# EAGLE design magnetolocator (EAGLE 9.5.2)
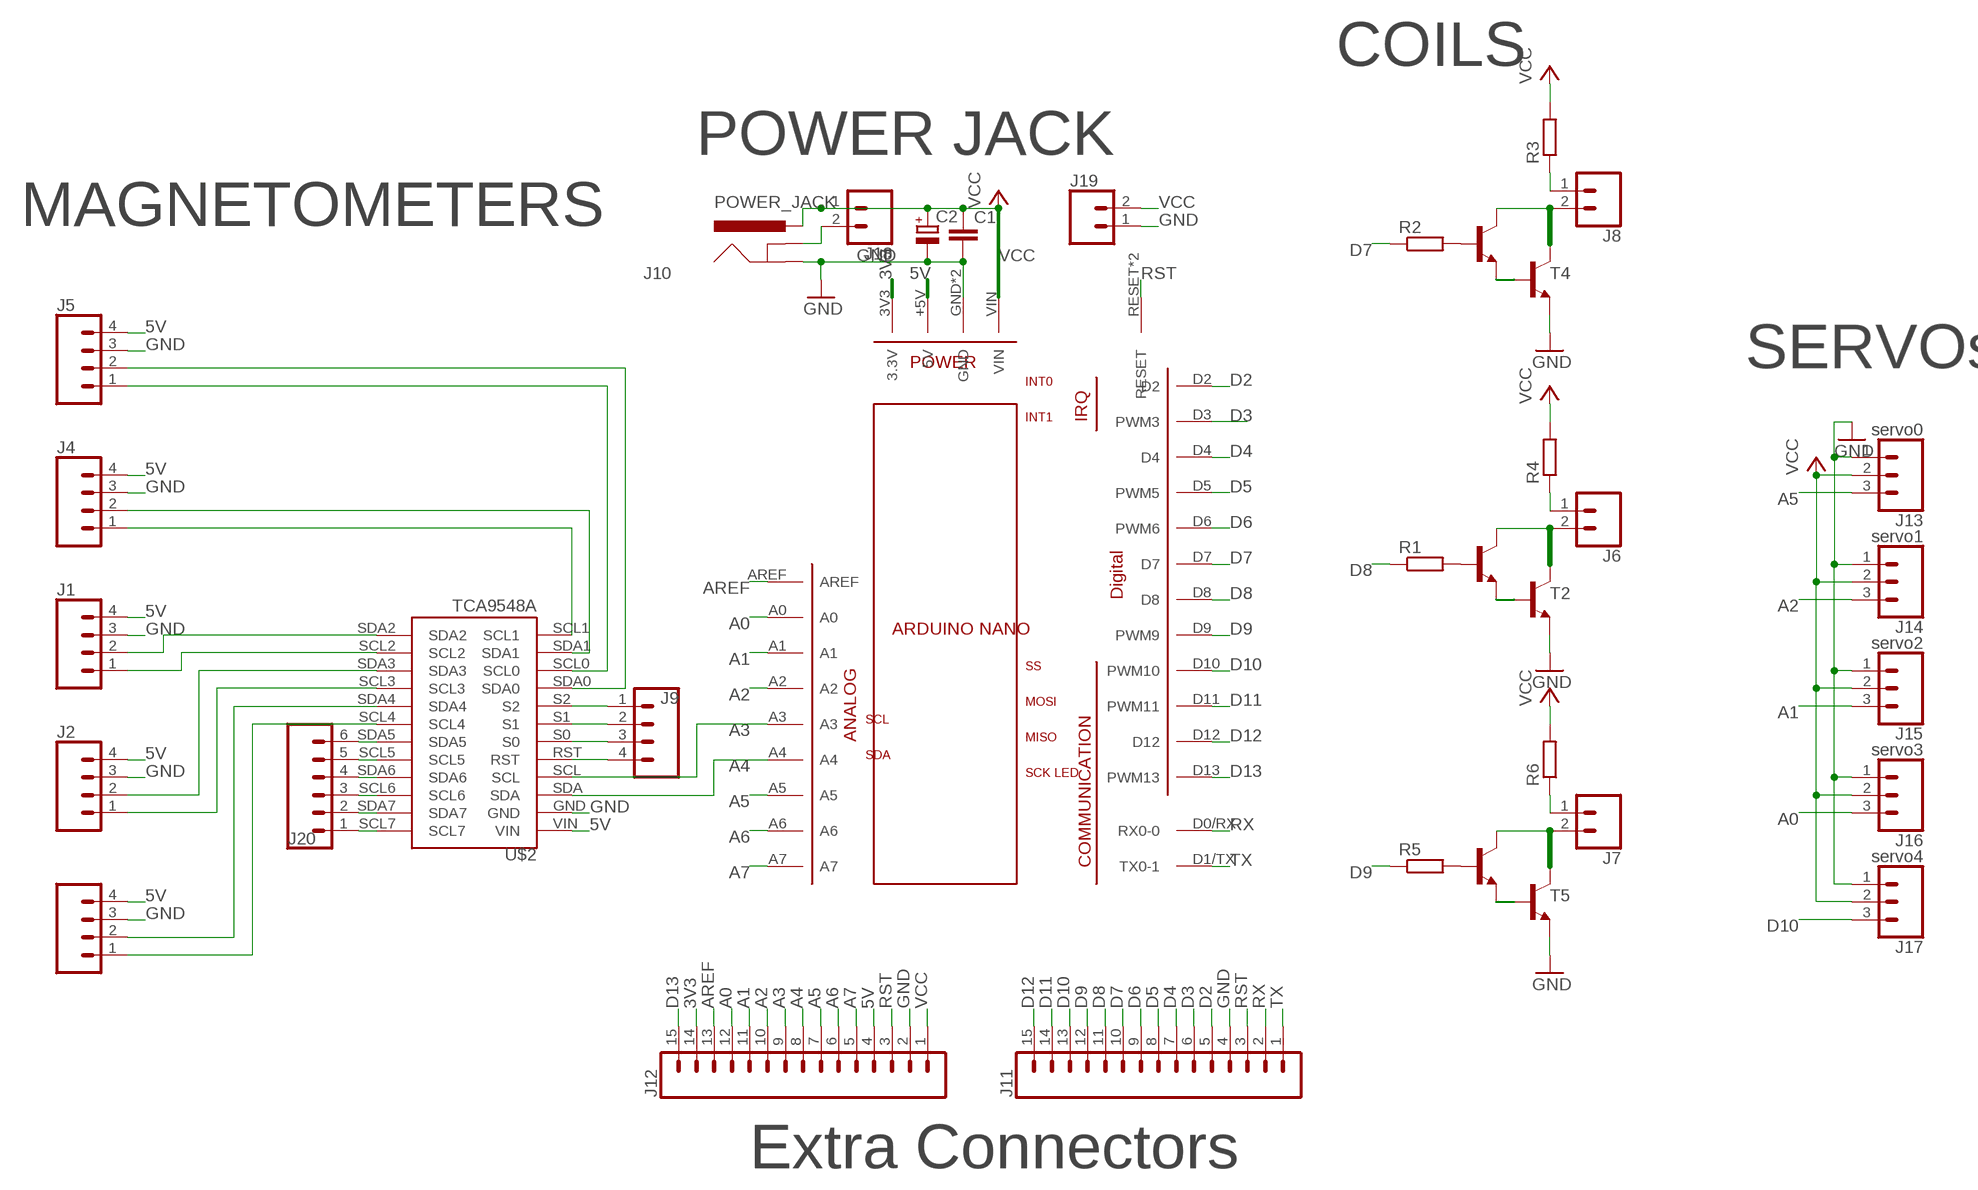
[diagram p0: schematic, sheet 1]

## Parts
C1  C-EU025-025X050  [C025-025X050]
C2  CPOL-EUE2.5-5  [E2,5-5]
J1  CONN_04PTH  [1X04]
J2  CONN_04PTH  [1X04]
J3  CONN_04PTH  [1X04]
J4  CONN_04PTH  [1X04]
J5  CONN_04PTH  [1X04]
J6  CONN_02  [1X02]
J7  CONN_02  [1X02]
J8  CONN_02  [1X02]
J9  CONN_04PTH  [1X04]
J10  POWER_JACK  [POWER_JACK_PTH]
J11  CONN_15  [1X15]
J12  CONN_15  [1X15]
J13  servo0  CONN_03  [1X03]
J14  servo1  CONN_03  [1X03]
J15  servo2  CONN_03  [1X03]
J16  servo3  CONN_03  [1X03]
J17  servo4  CONN_03  [1X03]
J18  CONN_02  [1X02]
J19  CONN_02  [1X02]
J20  CONN_06NO_SILK_FEMALE_PTH  [1X06_NO_SILK]
R1  R-EU_0207/2V  [0207/2V]
R2  R-EU_0207/2V  [0207/2V]
R3  R-EU_0207/2V  [0207/2V]
R4  R-EU_0207/2V  [0207/2V]
R5  R-EU_0207/2V  [0207/2V]
R6  R-EU_0207/2V  [0207/2V]
T1  2N2222-NPN-TO92-EBC  [TO92-EBC]
T2  2N2222-NPN-TO92-EBC  [TO92-EBC]
T3  2N2222-NPN-TO92-EBC  [TO92-EBC]
T4  2N2222-NPN-TO92-EBC  [TO92-EBC]
T5  2N2222-NPN-TO92-EBC  [TO92-EBC]
T6  2N2222-NPN-TO92-EBC  [TO92-EBC]
U$1  BOARD_ARDUINO-NANO  [BOARD_ARDUINO_NANO]
U$2  TCA9548A  [TCA9548A]

## Nets
3V3 [darlington]: J12.14 U$1.3V3(3.3V)
5V [power]: J1.4 J2.4 J3.4 J4.4 J5.4 J12.4 U$1.+5V(5V) U$2.VIN
A0: J12.12 J16.3 U$1.A0
A1: J12.11 J15.3 U$1.A1
A2: J12.10 J14.3 U$1.A2
A3: J12.9 U$1.A3 U$2.SCL
A4: J12.8 U$1.A4 U$2.SDA
A5: J12.7 J13.3 U$1.A5
A6: J12.6 U$1.A6
A7: J12.5 U$1.A7
AREF: J12.13 U$1.AREF
D2: J11.5 U$1.D2
D3: J11.6 U$1.D3(PWM3)
D4: J11.7 U$1.D4
D5: J11.8 U$1.D5(PWM5)
D6: J11.9 U$1.D6(PWM6)
D7: J11.10 R2.1 U$1.D7
D8: J11.11 R1.1 U$1.D8
D9: J11.12 R5.1 U$1.D9(PWM9)
D10: J11.13 J17.3 U$1.D10(PWM10)
D11: J11.14 U$1.D11(PWM11)
D12: J11.15 U$1.D12
D13: J12.15 U$1.D13(PWM13)
GND: C1.2 C2.- J1.3 J2.3 J3.3 J4.3 J5.3 J10.GND J11.4 J12.2 J13.1 J14.1 J15.1 J16.1 J17.1 J19.1 T2.E T4.E T5.E U$1.GND U$1.GND1(GND) U$2.GND
N$1: R2.2 T1.B
N$2: R1.2 T3.B
N$3: J3.1 U$2.SCL4
N$4: J3.2 U$2.SDA4
N$5 [coils]: J8.1 R3.1
N$6: J10.GNDBREAK J18.2
N$7 [darlington]: T1.E T4.B
N$8 [coils]: J8.2 T1.C T4.C
N$9: J2.1 U$2.SCL3
N$10: J2.2 U$2.SDA3
N$11 [coils]: J6.1 R4.1
N$12 [darlington]: T2.B T3.E
N$13: J1.1 U$2.SCL2
N$14: J1.2 U$2.SDA2
N$15 [coils]: J6.2 T2.C T3.C
N$16: R5.2 T6.B
N$17: J4.1 U$2.SCL1
N$18: J4.2 U$2.SDA1
N$19 [coils]: J7.1 R6.1
N$20 [darlington]: T5.B T6.E
N$21: J5.1 U$2.SCL0
N$22: J5.2 U$2.SDA0
N$23 [coils]: J7.2 T5.C T6.C
N$24: J9.1 U$2.S2
N$25: J9.2 U$2.S1
N$26: J9.3 U$2.S0
N$27: J9.4 U$2.RST
N$28: J20.1 U$2.SCL7
N$29: J20.2 U$2.SDA7
N$30: J20.3 U$2.SCL6
N$31: J20.4 U$2.SDA6
N$32: J20.5 U$2.SCL5
N$33: J20.6 U$2.SDA5
RST: J11.3 J12.3 U$1.RESET U$1.RESET1(RESET)
RX: J11.2 U$1.D0/RX(RX0-0)
TX: J11.1 U$1.D1/TX(TX0-1)
VCC [power]: C1.1 C2.+ J10.PWR J12.1 J13.2 J14.2 J15.2 J16.2 J17.2 J18.1 J19.2 R3.2 R4.2 R6.2 U$1.VIN

## Notes on the sheet
- COILS
- POWER JACK
- MAGNETOMETERS
- SERVOs
- Extra Connectors

## Library data of the parts
C1 = rcl:C-EU: CAPACITOR, European symbol; SPICEPREFIX: C
C2 = rcl:CPOL-EU: POLARIZED CAPACITOR, European symbol; SPICEPREFIX: C
J1-J5 J9 = SparkFun-Connectors:CONN_04: Multi connection point. Often used as Generic Header-pin footprint for 0.1 inch spaced/style header connections On any of the 0.1 inch spaced packages, you can populate with these: Break Away Headers - Straight <https://www.sparkfun.com/products/116> (PRT-00116) Break Away Male Headers - Right Angle <https://www.sparkfun.com/products/553> (PRT-00553) Female Headers <https://www.sparkfun.com/products/115> (PRT-00115) Break Away Headers - Machine Pin <https://www.sparkfun.com/products/117> (PRT-00117) Break Away Female Headers - Swiss Machine Pin <https://www.sparkfun.com/products/743> (PRT-00743) For SCREWTERMINALS and SPRING TERMINALS visit here: Screw Terimnals on SparkFun.com <https://www.sparkfun.com/search/results?term=Screw+Terminals> (5mm/3.5mm/2.54mm spacing) This device is also useful as a general connection point to wire up your design to another part of your project. Our various solder wires solder well into these plated through hole pads. Hook-Up Wire - Assortment (Stranded, 22 AWG) <https://www.sparkfun.com/products/11375> (PRT-11375) Hook-Up Wire - Assortment (Solid Core, 22 AWG) <https://www.sparkfun.com/products/11367> (PRT-11367) View the entire wire category on our website here <https://www.sparkfun.com/categories/141> Special notes: Molex polarized connector foot print use with SKU : PRT-08231 with associated crimp pins and housings. 1MM SMD Version SKU: PRT-10208; PROD_ID: CONN-09696
J6-J8 J18 J19 = SparkFun-Connectors:CONN_02: Multi connection point. Often used as Generic Header-pin footprint for 0.1 inch spaced/style header connections On any of the 0.1 inch spaced packages, you can populate with these: Break Away Headers - Straight <https://www.sparkfun.com/products/116> (PRT-00116) Break Away Male Headers - Right Angle <https://www.sparkfun.com/products/553> (PRT-00553) Female Headers <https://www.sparkfun.com/products/115> (PRT-00115) Break Away Headers - Machine Pin <https://www.sparkfun.com/products/117> (PRT-00117) Break Away Female Headers - Swiss Machine Pin <https://www.sparkfun.com/products/743> (PRT-00743) For SCREWTERMINALS and SPRING TERMINALS visit here: Screw Terimnals on SparkFun.com <https://www.sparkfun.com/search/results?term=Screw+Terminals> (5mm/3.5mm/2.54mm spacing) This device is also useful as a general connection point to wire up your design to another part of your project. Our various solder wires solder well into these plated through hole pads. Hook-Up Wire - Assortment (Stranded, 22 AWG) <https://www.sparkfun.com/products/11375> (PRT-11375) Hook-Up Wire - Assortment (Solid Core, 22 AWG) <https://www.sparkfun.com/products/11367> (PRT-11367) View the entire wire category on our website here <https://www.sparkfun.com/categories/141> Special notes: Molex polarized connector foot print use with: PRT-08233 with associated crimp pins and housings. 2.54_SCREWTERM for use with PRT-10571. 3.5mm Screw Terminal footprints for PRT-08084 5mm Screw Terminal footprints for use with PRT-08432
J10 = SparkFun-Connectors:POWER_JACK: Power Jack Connector This is the standard 5.5mm barrel jack for power. The PTH is the most common, proven, reliable, footprint. The Slot footprint only works if the mill layer is transmitted to the PCB fab house so be warned. Here are the connectors we sell at SparkFun: DC Barrel Power Jack/Connector <https://www.sparkfun.com/products/119> (PRT-00119) DC Barrel Power Jack/Connector (SMD) <https://www.sparkfun.com/products/12748> (PRT-12748) DC Barrel Jack Adapter - Breadboard Compatible <https://www.sparkfun.com/products/10811> (PRT-10811) It is used on this SparkFun product (and many, many others): SparkFun RedBoard - Programmed with Arduino <https://www.sparkfun.com/products/12757> (DEV-12757) Also, if you need a mating power supply or connector, please check these out: Wall Adapter Power Supply - 9VDC 650mA <https://www.sparkfun.com/products/298> (TOL-00298) DC Barrel Jack Adapter - Male <https://www.sparkfun.com/products/10287> (PRT-10287); PROD_ID: CONN-08197
J11 J12 = SparkFun-Connectors:CONN_15: Multi connection point. Often used as Generic Header-pin footprint for 0.1 inch spaced/style header connections On any of the 0.1 inch spaced packages, you can populate with these: Break Away Headers - Straight <https://www.sparkfun.com/products/116> (PRT-00116) Break Away Male Headers - Right Angle <https://www.sparkfun.com/products/553> (PRT-00553) Female Headers <https://www.sparkfun.com/products/115> (PRT-00115) Break Away Headers - Machine Pin <https://www.sparkfun.com/products/117> (PRT-00117) Break Away Female Headers - Swiss Machine Pin <https://www.sparkfun.com/products/743> (PRT-00743) For SCREWTERMINALS and SPRING TERMINALS visit here: Screw Terimnals on SparkFun.com <https://www.sparkfun.com/search/results?term=Screw+Terminals> (5mm/3.5mm/2.54mm spacing) This device is also useful as a general connection point to wire up your design to another part of your project. Our various solder wires solder well into these plated through hole pads. Hook-Up Wire - Assortment (Stranded, 22 AWG) <https://www.sparkfun.com/products/11375> (PRT-11375) Hook-Up Wire - Assortment (Solid Core, 22 AWG) <https://www.sparkfun.com/products/11367> (PRT-11367) View the entire wire category on our website here <https://www.sparkfun.com/categories/141> Special notes: Molex polarized connector foot print use with SKU : PRT-08231 with associated crimp pins and housings. 1MM SMD Version SKU: PRT-10208 NOTES ON THE VARIANTS LOCK and LOCK_LONGPADS... This footprint was designed to help hold the alignment of a through-hole component (i.e. 6-pin header) while soldering it into place. You may notice that each hole has been shifted either up or down by 0.005 of an inch from it's more standard position (which is a perfectly straight line). This slight alteration caused the pins (the squares in the middle) to touch the edges of the holes. Because they are alternating, it causes a "brace" to hold the component in place. 0.005 has proven to be the perfect amount of "off-center" position when using our standard breakaway headers. Although looks a little odd when you look at the bare footprint, once you have a header in there, the alteration is very hard to notice. Also,if you push a header all the way into place, it is covered up entirely on the bottom side.
J13-J17 = SparkFun-Connectors:CONN_03: Multi connection point. Often used as Generic Header-pin footprint for 0.1 inch spaced/style header connections On any of the 0.1 inch spaced packages, you can populate with these: Break Away Headers - Straight <https://www.sparkfun.com/products/116> (PRT-00116) Break Away Male Headers - Right Angle <https://www.sparkfun.com/products/553> (PRT-00553) Female Headers <https://www.sparkfun.com/products/115> (PRT-00115) Break Away Headers - Machine Pin <https://www.sparkfun.com/products/117> (PRT-00117) Break Away Female Headers - Swiss Machine Pin <https://www.sparkfun.com/products/743> (PRT-00743) Stackable Header - 3 Pin (Female, 0.1") <https://www.sparkfun.com/products/13875> (PRT-13875) For SCREWTERMINALS and SPRING TERMINALS visit here: Screw Terimnals on SparkFun.com <https://www.sparkfun.com/search/results?term=Screw+Terminals> (5mm/3.5mm/2.54mm spacing) This device is also useful as a general connection point to wire up your design to another part of your project. Our various solder wires solder well into these plated through hole pads. Hook-Up Wire - Assortment (Stranded, 22 AWG) <https://www.sparkfun.com/products/11375> (PRT-11375) Hook-Up Wire - Assortment (Solid Core, 22 AWG) <https://www.sparkfun.com/products/11367> (PRT-11367) View the entire wire category on our website here <https://www.sparkfun.com/categories/141> Special notes: Molex polarized connector foot print use with SKU : PRT-08232 with associated crimp pins and housings.; PROD_ID: XXX-00000; VALUE: 455-1750-1-ND
J20 = SparkFun-Connectors:CONN_06: Multi connection point. Often used as Generic Header-pin footprint for 0.1 inch spaced/style header connections On any of the 0.1 inch spaced packages, you can populate with these: Break Away Headers - Straight <https://www.sparkfun.com/products/116> (PRT-00116) Break Away Male Headers - Right Angle <https://www.sparkfun.com/products/553> (PRT-00553) Female Headers <https://www.sparkfun.com/products/115> (PRT-00115) Break Away Headers - Machine Pin <https://www.sparkfun.com/products/117> (PRT-00117) Break Away Female Headers - Swiss Machine Pin <https://www.sparkfun.com/products/743> (PRT-00743) Arduino Stackable Header - 6 Pin <https://www.sparkfun.com/products/9280> (PRT-09280) For SCREWTERMINALS and SPRING TERMINALS visit here: Screw Terimnals on SparkFun.com <https://www.sparkfun.com/search/results?term=Screw+Terminals> (5mm/3.5mm/2.54mm spacing) This device is also useful as a general connection point to wire up your design to another part of your project. Our various solder wires solder well into these plated through hole pads. Hook-Up Wire - Assortment (Stranded, 22 AWG) <https://www.sparkfun.com/products/11375> (PRT-11375) Hook-Up Wire - Assortment (Solid Core, 22 AWG) <https://www.sparkfun.com/products/11367> (PRT-11367) View the entire wire category on our website here <https://www.sparkfun.com/categories/141>; PROD_ID: CONN-08437
R1-R6 = rcl:R-EU_: RESISTOR, European symbol; SPICEPREFIX: R
T1-T6 = transistor-neu-to92:*-NPN-: NPN Transistror
U$1 = nano_v3:BOARD_ARDUINO-NANO
U$2 = custom_component:TCA9548A

## Net classes
1 coils: width 0.508 mm
2 power: width 0.508 mm
3 darlington: width 0.381 mm

## Board
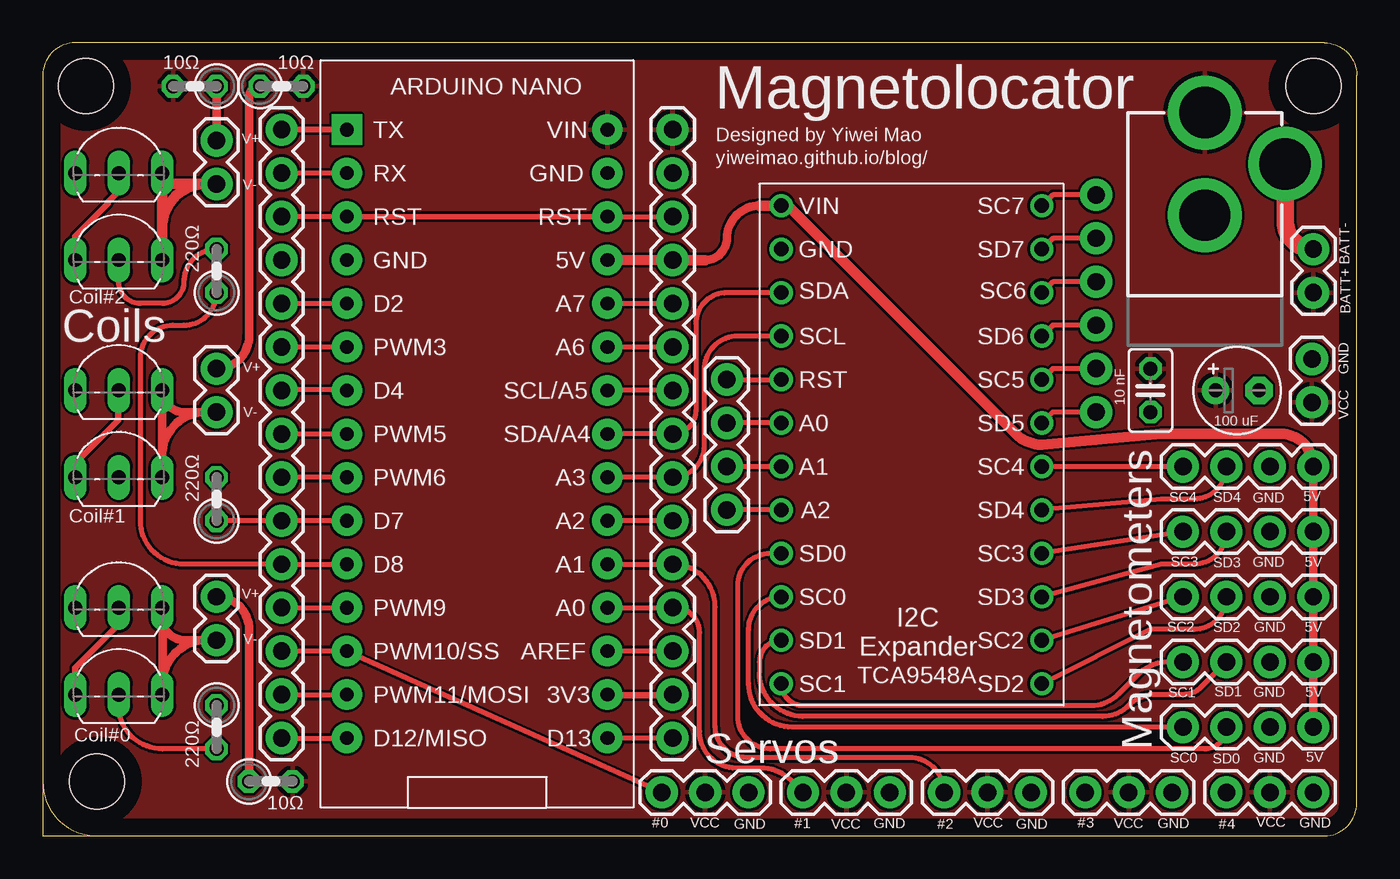
[diagram p1: board, top side]
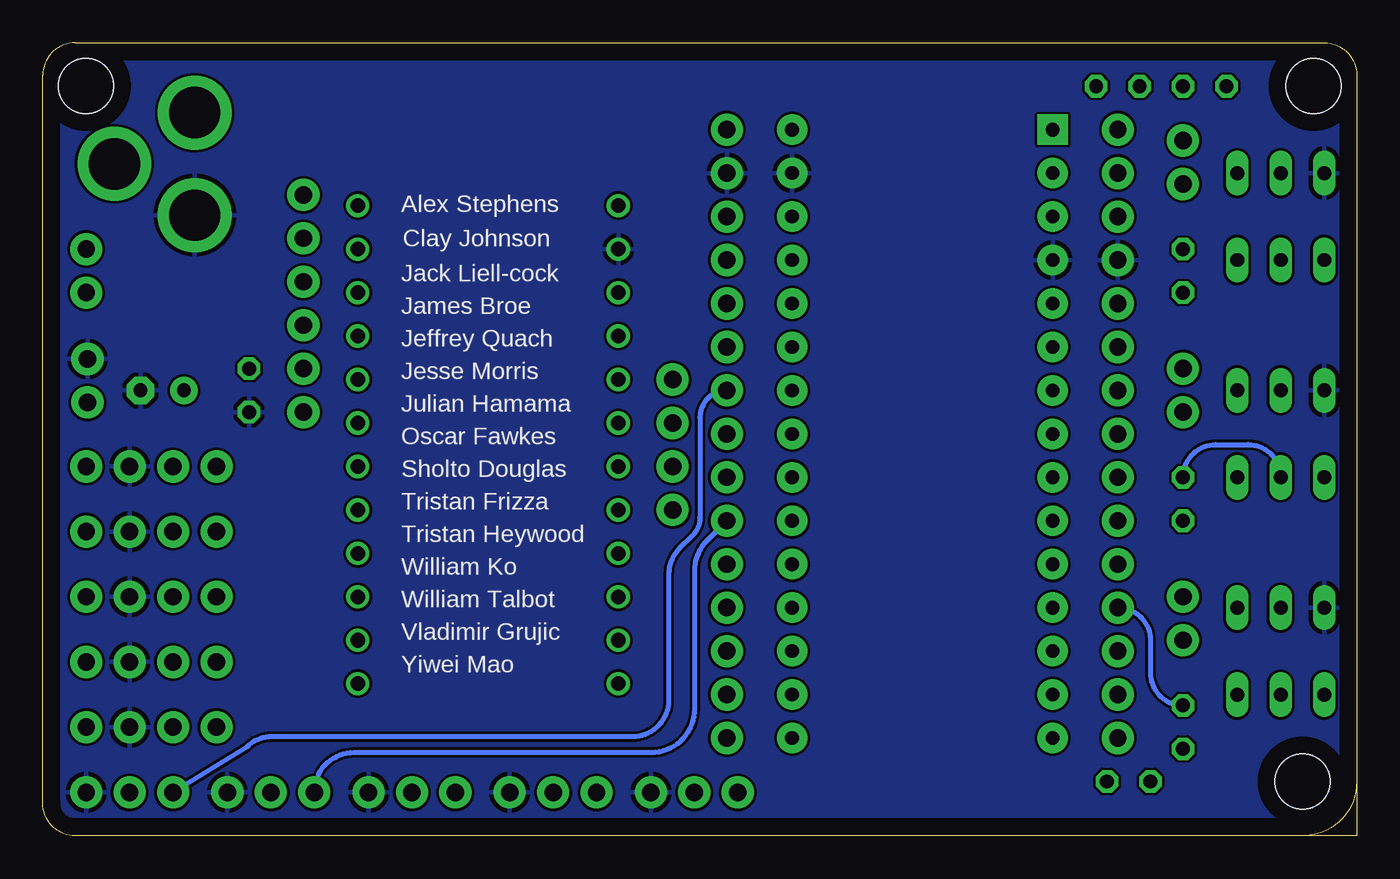
[diagram p2: board, bottom side, seen from below]

Size 76.83 x 46.35 mm. Coordinates in mm from the lower left corner, seen from the top.
Outline: 3.17,0 0,0 0,3.17
Outline: 3.17,0 74.93,0 arc90 76.83,1.91 76.83,44.45 arc90 74.93,46.35 1.91,46.35 arc90 0,44.45 0,3.17
Outline: 0,3.17 arc90 3.17,0
Copper layers (1*16): Top 0.035mm / dielectric 1.5mm / Bottom 0.035mm
Design rules "default": minimum track width 6mil, minimum drill 0.35mm, track to track 6mil, track to pad 6mil, pad to pad 6mil, via to via 6mil, smd to smd 6mil, copper to edge 40mil, drill to drill 6mil, minimum pad ring 10mil, minimum via ring 8mil, stop-mask expansion 4mil, vias tented up to drill 0mil, thermal gap 10mil
Holes 3.2 mm at 3.17,3.17 74.3,43.81 2.54,43.81

### Footprints (pad centres in the part's own frame; a part is rotated, then mirrored left to right if it is on the bottom)
C025-025X050 = drill 0.813 octagon: 1 -1.27,0; 2 1.27,0
E2,5-5 = drill 0.813 pad 1.6: + -1.27,0 | drill 0.813 pad 1.6 octagon: - 1.27,0
1X04 = drill 1.016 pad 1.88: 1 0,0; 2 2.54,0; 3 5.08,0; 4 7.62,0
1X02 = drill 1.016 pad 1.88: 1 0,0; 2 2.54,0
POWER_JACK_PTH = drill 2.997 pad 4.318: GND 0,7.7; GNDBREAK 4.7,10.7; PWR 0,13.7
1X15 = drill 1.016 pad 1.88: 1 0,0; 2 2.54,0; 3 5.08,0; 4 7.62,0; 5 10.16,0; 6 12.7,0; 7 15.24,0; 8 17.78,0; 9 20.32,0; 10 22.86,0; 11 25.4,0; 12 27.94,0; 13 30.48,0; 14 33.02,0; 15 35.56,0
1X03 = drill 1.016 pad 1.88: 1 0,0; 2 2.54,0; 3 5.08,0
1X06_NO_SILK = drill 1.016 pad 1.88: 1 0,0; 2 2.54,0; 3 5.08,0; 4 7.62,0; 5 10.16,0; 6 12.7,0
0207/2V = drill 0.813 octagon: 1 -1.27,0; 2 1.27,0
TO92-EBC = drill 0.813 long: B 0,-1.27; C 2.54,-1.27; E -2.54,-1.27
BOARD_ARDUINO_NANO = drill 0.8 pad 1.778: 3V3 15.24,2.54; +5V 15.24,27.94; A0 15.24,7.62; A1 15.24,10.16; A2 15.24,12.7; A3 15.24,15.24; A4 15.24,17.78; A5 15.24,20.32; A6 15.24,22.86; A7 15.24,25.4; AREF 15.24,5.08; D0/RX 0,33.02; D2 0,25.4; D3 0,22.86; D4 0,20.32; D5 0,17.78; D6 0,15.24; D7 0,12.7; D8 0,10.16; D9 0,7.62; D10 0,5.08; D11 0,2.54; D12 0,0; D13 15.24,0; GND 0,27.94; GND1 15.24,33.02; RESET 0,30.48; RESET1 15.24,30.48; VIN 15.24,35.56 | drill 0.8 pad 1.778 square: D1/TX 0,35.56
TCA9548A = drill 0.85: GND 1.27,26.67; RST 1.27,19.05; S0 1.27,16.51; S1 1.27,13.97; S2 1.27,11.43; SCL 1.27,21.59; SCL0 1.27,6.35; SCL1 1.27,1.27; SCL2 16.51,3.81; SCL3 16.51,8.89; SCL4 16.51,13.97; SCL5 16.51,19.05; SCL6 16.51,24.13; SCL7 16.51,29.21; SDA 1.27,24.13; SDA0 1.27,8.89; SDA1 1.27,3.81; SDA2 16.51,1.27; SDA3 16.51,6.35; SDA4 16.51,11.43; SDA5 16.51,16.51; SDA6 16.51,21.59; SDA7 16.51,26.67; VIN 1.27,29.21

### Placement (x,y rotation side)
C1  64.77,26.04 270 top
C2  69.85,26.04 0 top
J1  66.67,13.97 0 top
J2  66.67,17.78 0 top
J3  66.67,21.59 0 top
J4  66.67,10.16 0 top
J5  66.67,6.35 0 top
J6  10.16,40.64 270 top
J7  10.16,13.97 270 top
J8  10.16,27.3 270 top
J9  40.01,19.05 90 top
J10  67.94,28.57 0 top
J11  13.97,41.27 270 top
J12  36.83,41.27 270 top
J13  74.3,2.54 180 top
J14  66.04,2.54 180 top
J15  57.78,2.54 180 top
J16  49.53,2.54 180 top
J17  41.27,2.54 180 top
J18  74.3,31.75 90 top
J19  74.22,27.87 270 top
J20  61.59,37.47 270 top
R1  10.16,33.02 90 top
R2  10.16,19.68 90 top
R3  13.97,43.81 0 top
R4  8.89,43.81 180 top
R5  10.16,6.35 270 top
R6  13.34,3.17 0 top
T1  4.45,22.23 0 top
T2  4.45,40.01 0 top
T3  4.45,34.92 0 top
T4  4.45,27.3 0 top
T5  4.45,14.61 0 top
T6  4.45,9.53 0 top
U$1  17.78,5.71 0 top
U$2  41.91,7.62 0 top

### Tracks (layer width: path | path; a pad name or v marks a point on that pad's centre or on a via)
3V3
  Top 0.381: U$1.3V3 33.07,8.23 36.8,8.23 J12.14
5V
  Top 0.508: 33.07,33.68 U$1.+5V | J5.4 J4.4 J1.4 J2.4 J3.4 | 41.91,36.83 arc90 40.01,34.92 arc-90 38.73,33.66
  Top 0.61: J3.4 arc90 72.39,23.5 65.41,23.5 58.42,22.86 arc-45 56.9,23.49 43.66,36.73 U$2.VIN 41.91,36.83 | 38.73,33.66 J12.4 33.07,33.68
A0
  Top 0.305: U$1.A0 J12.12 36.96,13.34 arc-90 38.41,11.89 38.41,6.1 arc90 40.54,3.96 41.98,3.96 arc-45 43.77,3.22 J16.3
A1
  Top 0.152: U$1.A1 33.05,15.85 | 36.8,15.85 J12.11
  Top 0.305: 33.05,15.85 36.8,15.85 arc90 J12.11 arc-90 39.32,13.39 39.32,6.4 arc90 41.15,4.57 50.67,4.57 arc-90 J15.3
A2
  Top 0.152: U$1.A2 33.05,18.44 | 36.8,18.44 J12.10
  Top 0.305: U$1.A2 arc-90 33.05,18.44 36.8,18.44
  Bottom 0.305: J14.3 arc90 58.62,4.88 41.25,4.88 arc-90 38.71,7.42 38.71,15.48 arc45 37.97,17.28 J12.10
A3
  Top 0.305: U$1.A3 J12.9 arc90 38.67,22.79 38.67,27.24 arc-90 40.64,29.21 U$2.SCL
A4
  Top 0.305: U$2.SDA 40.01,31.75 arc90 38.19,29.93 38.19,24.85 arc-90 J12.8 U$1.A4
A5
  Top 0.152: U$1.A5 33.05,26.06 36.8,26.06 J12.7
  Top 0.305: J12.7 U$1.A5
  Bottom 0.305: J12.7 arc-90 38.41,24.46 38.41,18.59 arc45 38.84,17.55 39.62,16.76 arc-45 40.23,15.29 40.23,7.92 arc90 42.37,5.79 63.45,5.79 arc-45 64.92,5.18 J13.3
A6
  Top 0.305: U$1.A6 J12.6
A7
  Top 0.152: U$1.A7 33.05,31.09 36.8,31.09 J12.5
  Top 0.305: U$1.A7 36.78,31.11 arc-90 36.8,31.09
AREF
  Top 0.152: U$1.AREF 33.05,10.82 | 36.8,10.82 J12.13
  Top 0.305: U$1.AREF arc-90 33.05,10.82 36.8,10.82
D2
  Top 0.152: U$1.D2 17.75,31.09 14.02,31.09 J11.5
  Top 0.305: J11.5 17.73,31.11 arc-90 17.75,31.09
D3
  Top 0.305: J11.6 U$1.D3
D4
  Top 0.152: 17.75,26.06 U$1.D4 | 14.02,26.06 J11.7
  Top 0.305: U$1.D4 arc90 17.75,26.06 14.02,26.06
D5
  Top 0.152: U$1.D5 17.75,23.47 14.02,23.47 J11.8
  Top 0.305: J11.8 17.73,23.5 arc-90 17.75,23.47
D6
  Top 0.305: U$1.D6 J11.9
D7
  Top 0.152: R2.1 10.21,18.44 13.95,18.44 J11.10 14.02,18.44 17.75,18.44 U$1.D7
  Top 0.305: R2.1 arc-90 10.19,18.44 13.95,18.44 | J11.10 arc-90 13.99,18.44 17.75,18.44
D8
  Top 0.305: R1.1 arc-90 8.26,29.84 7.62,29.84 arc90 5.71,27.94 5.71,18.41 arc90 8.26,15.88 J11.11 U$1.D8
D9
  Top 0.305: J11.12 U$1.D9
  Bottom 0.305: J11.12 arc90 12.06,11.43 12.06,9.53 arc-90 R5.1
D10
  Top 0.152: 17.68,10.82 14.02,10.82 J11.13 | 17.75,10.82 U$1.D10
  Top 0.305: J11.13 arc-90 13.99,10.82 17.68,10.82 | 17.68,10.82 17.75,10.82 | J17.3 17.68,10.82
D11
  Top 0.152: 17.75,8.23 U$1.D11 | 14.02,8.23 J11.14
  Top 0.305: U$1.D11 arc-90 17.75,8.23 14.02,8.23
D12
  Top 0.305: J11.15 U$1.D12
D13
  Top 0.305: J12.15 U$1.D13
GND
  pour Bottom: 0.64,46.99 -0.64,45.72 -0.64,1.27 1.27,-0.64 76.2,-0.64 77.47,0.64 77.47,44.45 77.47,45.72 75.56,47.62 1.27,47.62
N$1
  Bottom 0.305: R2.2 arc90 8.26,22.86 6.35,22.86 arc90 T1.B
N$2
  Top 0.305: R1.2 arc90 8.26,32.38 arc-90 6.99,31.11 5.71,31.11 arc-90 4.45,32.38 T3.B
N$3
  Top 0.305: U$2.SCL4 J3.1
N$4
  Top 0.305: J3.2 arc-90 67.31,19.68 65.41,19.68 U$2.SDA4
N$5
  Top 0.508: R3.1 arc90 12.06,43.18 12.06,29.21 arc-90 J8.1
N$6
  Top 1.016: J18.2 arc-90 72.64,35.94 J10.GNDBREAK
N$7
  Top 0.381: T1.E 1.91,21.77 4.42,24.28 4.42,25.98 T4.B
N$8
  Top 0.508: 7.01,25.98 T4.C T1.C 6.99,22.23 arc-90 9.53,24.77 J8.2 8.23,24.77 arc-90 7.01,25.98
N$9
  Top 0.305: J2.1 U$2.SCL3
N$10
  Top 0.305: J2.2 arc-90 67.31,15.88 65.41,15.88 U$2.SDA3
N$11
  Top 0.508: R4.1 J6.1
N$12
  Top 0.381: T3.E 1.91,35.05 3.81,36.96 3.81,37.03 4.42,37.64 4.42,38.71 T2.B
N$13
  Top 0.305: J1.1 U$2.SCL2
N$14
  Top 0.305: J1.2 arc-90 67.31,12.06 64.77,12.06 U$2.SDA2
N$15
  Top 0.61: T2.C T3.C 6.99,35.56 arc-90 9.53,38.1 J6.2 7.62,38.1 arc-90 T2.C
N$16
  Top 0.305: R5.2 6.99,5.08 arc-90 4.45,7.62 T6.B
N$17
  Top 0.305: U$2.SCL1 arc90 44.45,7.62 61.33,7.62 arc45 62.87,8.26 64.03,9.42 arc-45 65.82,10.16 J4.1
N$18
  Top 0.305: U$2.SDA1 arc90 41.91,10.16 41.91,9.53 arc90 44.45,6.99 61.97,6.99 arc45 63.5,7.62 arc-45 65.03,8.26 66.67,8.26 arc45 67.76,8.7 J4.2
N$19
  Top 0.508: R6.1 12.06,12.06 arc90 J7.1
N$20
  Top 0.381: T6.E 1.91,9.83 4.42,12.34 4.42,13.34 T5.B
N$21
  Top 0.305: J5.1 43.81,6.35 arc-90 41.27,8.89 41.27,12.06 arc-90 U$2.SCL0
N$22
  Top 0.305: J5.2 arc-90 67.94,5.08 42.55,5.08 arc-90 40.64,6.99 40.64,14.61 arc-90 42.55,16.51 U$2.SDA0
N$23
  Top 0.508: 7.01,12.7 7.01,13.34 T5.C | 7.01,12.7 7.01,8.89 | T6.C 7.01,8.31 7.01,8.89 | 7.01,12.7 arc90 8.28,11.43 J7.2 9.55,11.43 arc90 7.01,8.89
N$24
  Top 0.305: U$2.S2 J9.1
N$25
  Top 0.305: J9.2 U$2.S1
N$26
  Top 0.305: U$2.S0 J9.3
N$27
  Top 0.305: J9.4 U$2.RST
N$28
  Top 0.305: J20.1 59.05,37.47 U$2.SCL7
N$29
  Top 0.305: J20.2 59.05,34.92 U$2.SDA7
N$30
  Top 0.305: J20.3 59.05,32.38 U$2.SCL6
N$31
  Top 0.305: J20.4 59.05,29.84 U$2.SDA6
N$32
  Top 0.305: J20.5 59.05,27.3 U$2.SCL5
N$33
  Top 0.305: J20.6 59.05,24.77 U$2.SDA5
RST
  Top 0.152: U$1.RESET 18.67,36.2 18.75,36.27 32.08,36.27 32.16,36.2 U$1.RESET1
  Top 0.305: J11.3 U$1.RESET U$1.RESET1 J12.3
RX
  Top 0.152: U$1.D0/RX 17.75,38.71 14.02,38.71 J11.2
  Top 0.305: U$1.D0/RX J11.2
TX
  Top 0.152: U$1.D1/TX 17.68,41.38 14.1,41.38 14.02,41.3 J11.1
  Top 0.305: J11.1 U$1.D1/TX
VCC
  pour Top: 0,46.35 -0.64,45.72 -0.64,0.64 0.64,-0.64 76.2,-0.64 77.47,0.64 77.47,44.45 77.47,45.72 76.2,46.99 0.64,46.99

### Text on the board
tPlace: 10Ω | 10Ω | Magnetolocator | Designed by Yiwei Mao | V+ | yiweimao.github.io/blog/ | V- | 220Ω | BATT- | Coil#2 | BATT+ | Coils | V+ | GND | 10 nF | 100 uF | V- | VCC | 220Ω | 5V | SC4 | SD4 | GND | Coil#1 | SC3 | SD3 | GND | 5V | V+ | SC2 | SD2 | GND | 5V | V- | SC1 | SD1 | GND | 5V | Coil#0 | Magnetometers | 220Ω | Servos | SC0 | SD0 | GND | 5V | 10Ω | #0 | VCC | GND | #1 | VCC | GND | #2 | VCC | GND | #3 | VCC | GND | #4 | VCC | GND
bPlace: Alex Stephens | Clay Johnson | Jack Liell-cock | James Broe | Jeffrey Quach | Jesse Morris | Julian Hamama | Oscar Fawkes | Sholto Douglas | Tristan Frizza | Tristan Heywood | William Ko | William Talbot | Vladimir Grujic | Yiwei Mao